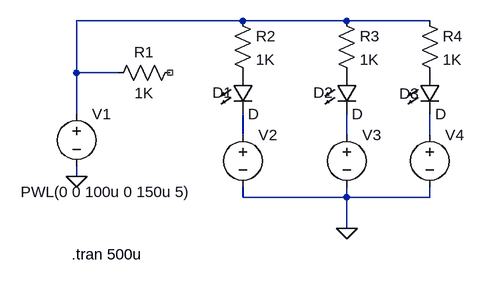
[diagram p0: schematic LED-white-sim.asc]
LED-white-sim.asc, the LTspice schematic file:
Version 4
SHEET 1 904 680
WIRE 320 -80 64 -80
WIRE 480 -80 320 -80
WIRE 608 -80 480 -80
WIRE 64 0 64 -80
WIRE 128 0 64 0
WIRE 64 64 64 0
WIRE 320 96 320 64
WIRE 480 96 480 64
WIRE 608 96 608 64
WIRE 64 160 64 144
WIRE 320 192 320 176
WIRE 480 192 480 176
WIRE 480 192 320 192
WIRE 608 192 608 176
WIRE 608 192 480 192
WIRE 480 240 480 192
FLAG 64 160 0
FLAG 480 240 0
SYMBOL voltage 64 48 R0
WINDOW 3 178 136 Right 2
WINDOW 123 0 0 Left 0
WINDOW 39 0 0 Left 0
SYMATTR InstName V1
SYMATTR Value PWL(0 0 100u 0 150u 5)
SYMBOL res 224 -16 R90
WINDOW 0 0 56 VBottom 2
WINDOW 3 32 56 VTop 2
SYMATTR InstName R1
SYMATTR Value 1K
SYMBOL LED 304 0 R0
WINDOW 0 -31 31 Left 2
SYMATTR InstName D1
SYMBOL LED 464 0 R0
WINDOW 0 -35 31 Left 2
SYMATTR InstName D2
SYMBOL LED 592 0 R0
WINDOW 0 -31 32 Left 2
SYMATTR InstName D3
SYMBOL voltage 320 80 R0
WINDOW 3 -135 140 Invisible 2
WINDOW 123 0 0 Left 0
WINDOW 39 0 0 Left 0
SYMATTR InstName V2
SYMATTR Value PWL(0 0 50u 0 100u 5 200u 5 210u 0)
SYMBOL voltage 480 80 R0
WINDOW 3 12 138 Invisible 2
WINDOW 123 0 0 Left 0
WINDOW 39 0 0 Left 0
SYMATTR InstName V3
SYMATTR Value PWL(0 0 50u 0 100u 5 250u 5 260u 0)
SYMBOL voltage 608 80 R0
WINDOW 3 -103 168 Invisible 2
WINDOW 123 0 0 Left 0
WINDOW 39 0 0 Left 0
SYMATTR InstName V4
SYMATTR Value PWL(0 0 50u 0 100u 5 300u 5 310u 0)
SYMBOL res 304 -96 R0
SYMATTR InstName R2
SYMATTR Value 1K
SYMBOL res 464 -96 R0
SYMATTR InstName R3
SYMATTR Value 1K
SYMBOL res 592 -96 R0
SYMATTR InstName R4
SYMATTR Value 1K
TEXT 56 280 Left 2 !.tran 500u

The netlist it stands for:
* LED-white-sim.asc
V1 N001 0 PWL(0 0 100u 0 150u 5)
R1 NC_01 N001 1K
D1 P001 N002 D
D2 P002 N003 D
D3 P003 N004 D
V2 N002 0 PWL(0 0 50u 0 100u 5 200u 5 210u 0)
V3 N003 0 PWL(0 0 50u 0 100u 5 250u 5 260u 0)
V4 N004 0 PWL(0 0 50u 0 100u 5 300u 5 310u 0)
R2 N001 P001 1K
R3 N001 P002 1K
R4 N001 P003 1K
.model D D
.lib standard.dio
.tran 500u
.backanno
.end